# Altium schematic sheet 07.SchDoc
size 386 x 246 mm
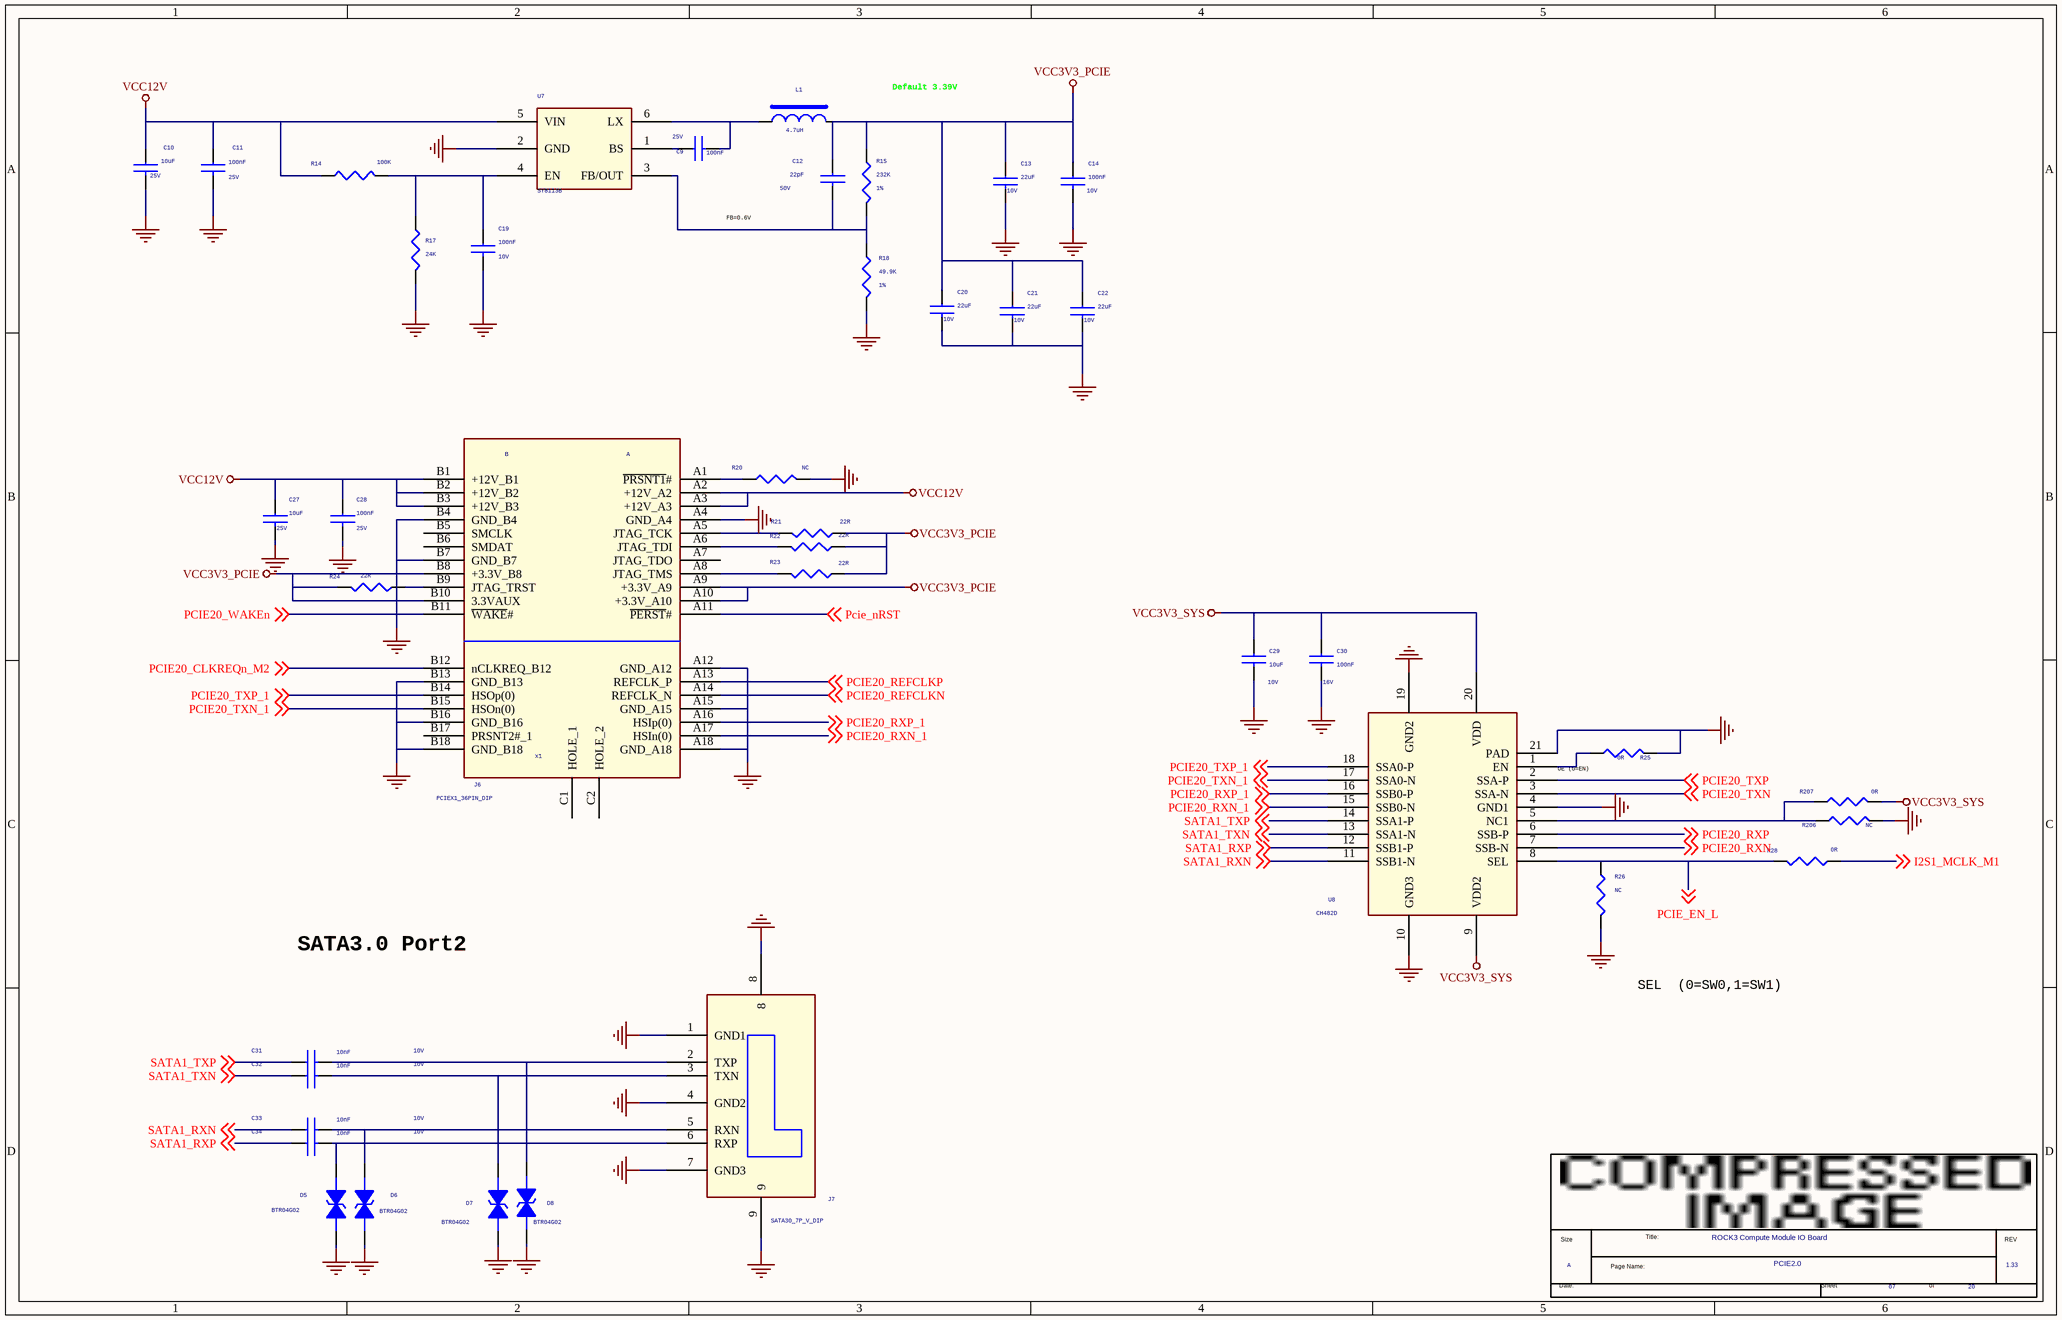
[diagram p0: 07.SchDoc]

## Parts
*  Page Count: 20  Page Number: 07  Page Size: A  Title: ROCK3 Compute Module IO Board  RevCode: 1.33  Doc: PCIE2.0  (hidden comment: radxa_1010)  (graphical)
C9  100nF  Voltage: 25V  [C0402]
C10  10uF  Voltage: 25V  [C1206]
C11  100nF  Voltage: 25V  [C0402]
C12  22pF  Voltage: 50V  [C0402]
C13  22uF  Voltage: 10V  [C0805]
C14  100nF  Voltage: 10V  [C0402]
C19  100nF  Voltage: 10V  [C0402]
C20  22uF  Voltage: 10V  [C0805]
C21  22uF  Voltage: 10V  [C0805]
C22  22uF  Voltage: 10V  [C0805]
C27  10uF  Voltage: 25V  [C1206]
C28  100nF  Voltage: 25V  [C0402]
C29  10uF  Voltage: 10V  [C0603]
C30  100nF  Voltage: 16V  [C0402]
C31  10nF  Voltage: 10V  [C0402]
C32  10nF  Voltage: 10V  [C0402]
C33  10nF  Voltage: 10V  [C0402]
C34  10nF  Voltage: 10V  [C0402]
D5  BTR04G02  [ESD0402_1xD5]
D6  BTR04G02  [ESD0402_1xD5]
D7  BTR04G02  [ESD0402_1xD5]
D8  BTR04G02  [ESD0402_1xD5]
J6  PCIEX1_36PIN_DIP  [PCIEX1_36PIN_DIP]
J7  SATA30_7P_V_DIP  [SMD_SATA_7P_50_180]
L1  4.7uH  [IND-5020]
R14  100K  [R0402]
R15  232K  Tolerance: 1%  [R0402]
R17  24K  [R0402]
R18  49.9K  Tolerance: 1%  [R0402]
R20  NC  [R0402]
R21  22R  [R0402]
R22  22R  [R0402]
R23  22R  [R0402]
R24  22R  [R0402]
R25  0R  [R0402]
R26  NC  [R0402]
R28  0R  [R0402]
R206  NC  [R0402]
R207  0R  [R0402]
U7  SY8113B  [SOT_23_6]
U8  CH482D  [CH482X]

## Nets
GND: C10.2 C11.2 C13.2 C14.2 C19.2 C20.2 C21.2 C22.2 C27.2 C28.2 C29.2 C30.2 D5.1 D6.1 D7.1 D8.1 J6.A4(GND_A4) J6.A12(GND_A12) J6.A15(GND_A15) J6.A18(GND_A18) J6.B4(GND_B4) J6.B7(GND_B7) J6.B13(GND_B13) J6.B16(GND_B16) J6.B18(GND_B18) J7.1(GND1) J7.4(GND2) J7.7(GND3) J7.8 J7.9 R17.2 R18.2 R20.2 R25.1 R26.2 R206.1 U7.2(GND) U8.4(GND1) U8.10(GND3) U8.19(GND2) U8.21(PAD)
VCC3V3_PCIE: C12.1 C13.1 C14.1 C20.1 C21.1 C22.1 J6.A9(+3.3V_A9) J6.A10(+3.3V_A10) J6.B8(+3.3V_B8) J6.B10(3.3VAUX) L1.2 R15.1 R21.2 R22.2 R23.2 R24.1
VCC3V3_SYS: C29.1 C30.1 R207.1 U8.9(VDD2) U8.20(VDD)
VCC12V: C10.1 C11.1 C27.1 C28.1 J6.A2(+12V_A2) J6.A3(+12V_A3) J6.B1(+12V_B1) J6.B2(+12V_B2) J6.B3(+12V_B3) R14.1 U7.5(VIN)
I2S1_MCLK_M1: R28.2 ; off-sheet I2S1_MCLK_M1
PCIE20_CLKREQn_M2: J6.B12(nCLKREQ_B12) ; off-sheet PCIE20_CLKREQn_M2
PCIE20_REFCLKN: J6.A14(REFCLK_N) ; off-sheet PCIE20_REFCLKN
PCIE20_REFCLKP: J6.A13(REFCLK_P) ; off-sheet PCIE20_REFCLKP
PCIE20_RXN: U8.7(SSB-N) ; off-sheet PCIE20_RXN
PCIE20_RXN_1: J6.A17(HSIn(0)) U8.15(SSB0-N) ; off-sheet PCIE20_RXN_1
PCIE20_RXP: U8.6(SSB-P) ; off-sheet PCIE20_RXP
PCIE20_RXP_1: J6.A16(HSIp(0)) U8.16(SSB0-P) ; off-sheet PCIE20_RXP_1
PCIE20_TXN: U8.3(SSA-N) ; off-sheet PCIE20_TXN
PCIE20_TXN_1: J6.B15(HSOn(0)) U8.17(SSA0-N) ; off-sheet PCIE20_TXN_1
PCIE20_TXP: U8.2(SSA-P) ; off-sheet PCIE20_TXP
PCIE20_TXP_1: J6.B14(HSOp(0)) U8.18(SSA0-P) ; off-sheet PCIE20_TXP_1
PCIE20_WAKEn: J6.B11(~{WAKE}#) ; off-sheet PCIE20_WAKEn
PCIE_EN_L: R26.1 R28.1 U8.8(SEL) ; off-sheet PCIE_EN_L
Pcie_nRST: J6.A11(~{PERST}#) ; off-sheet Pcie_nRST
SATA1_RXN: C33.1 U8.11(SSB1-N) ; off-sheet SATA1_RXN
SATA1_RXP: C34.1 U8.12(SSB1-P) ; off-sheet SATA1_RXP
SATA1_TXN: C32.1 U8.13(SSA1-N) ; off-sheet SATA1_TXN
SATA1_TXP: C31.1 U8.14(SSA1-P) ; off-sheet SATA1_TXP
NetC9_1: C9.1 U7.1(BS)
NetC9_2: C9.2 L1.1 U7.6(LX)
NetC12_2: C12.2 R15.2 R18.1 U7.3(FB/OUT)
NetC19_1: C19.1 R14.2 R17.1 U7.4(EN)
NetC31_2: C31.2 D8.2 J7.2(TXP)
NetC32_2: C32.2 D7.2 J7.3(TXN)
NetC33_2: C33.2 D6.2 J7.5(RXN)
NetC34_2: C34.2 D5.2 J7.6(RXP)
NetJ6_A1: J6.A1(~{PRSNT1}#) R20.1
NetJ6_A5: J6.A5(JTAG_TCK) R21.1
NetJ6_A6: J6.A6(JTAG_TDI) R22.1
NetJ6_A8: J6.A8(JTAG_TMS) R23.1
NetJ6_B9: J6.B9(JTAG_TRST) R24.2
NetR25_2: R25.2 U8.1(EN)
NetR206_2: R206.2 R207.2 U8.5(NC1)

Not connected (* = marked no-connect by the designer): J6 A7(JTAG_TDO) B5(SMCLK) B6(SMDAT) B17(PRSNT2#_1) C1(HOLE_1) C2(HOLE_2)

## Notes on the sheet
- Default 3.39V
- FB=0.6V
- (near R25) OE (0=EN)
- SATA3.0 Port2
- SEL  (0=SW0,1=SW1)
- (in symbol PCIE_4X_CON_1) B; x1
- (in symbol radxa_1010) Title:; Size; REV; Page Name:; Date:; Sheet; of

## Library data of the parts
C9 = CAP NP_0: cap,100.00nF,+/-10%,25V,X5R,C0402; Manufacturer: TDK; Number: 37; RK PN: C1005X5R1E104K050BC; Priority: A; Tolerance: 10%; C_Voltage: 6.3V; Dielectric: X5R; Part Type: C0402; Manufacturer PN: C1005X5R1E104K050BC; Created by: JJJ
C10 = CAP NP_0: cap,10.00uF,+/-10%,25V,X5R,C1206; Manufacturer: TDK; RK PN: C3216X5R1E106K085AC; Priority: A; C_Voltage: 6.3V; Tolerance: 10%; Dielectric: X5R; Part Type: C1206; Manufacturer PN: C3216X5R1E106K085AC; Created by: JJJ
C11 = CAP NP_0: cap,100.00nF,+/-10%,25V,X5R,C0402; Manufacturer PN: C1005X5R1E104K050BC; Manufacturer: TDK; Tolerance: 10%; Priority: A; Dielectric: X5R; Created by: JJJ; Part Type: C0402; RK PN: C1005X5R1E104K050BC
C12 = CAP NP_0: cap,22.00pF,+/-5%,50V,C0G,C0402; Manufacturer: TDK; RK PN: C1005C0G1H220J050BA; Priority: A; Tolerance: 5%; Dielectric: C0G; Part Type: C0402; Manufacturer PN: C1005C0G1H220J050BA; Created by: JJJ
C13 C21 C22 = CAP NP_0: cap,22.00uF,+/-10%,10V,X5R,C0805; Manufacturer: TDK; RK PN: C2012X5R1A226K125AB; Priority: A; C_Voltage: 6.3V; Tolerance: 10%; Dielectric: X5R; Part Type: C0805; Manufacturer PN: C2012X5R1A226K125AB; Created by: JJJ
C14 = CAP NP_0: cap,100.00nF,+/-10%,10V,X5R,C0402; Manufacturer: TDK; Number: 37; RK PN: C1005X5R1A104K050BA; Priority: A; Tolerance: 10%; C_Voltage: 6.3V; Dielectric: X5R; Part Type: C0402; Manufacturer PN: C1005X5R1A104K050BA; Created by: JJJ
C19 = CAP NP_0: cap,100.00nF,+/-10%,10V,X5R,C0402; Manufacturer PN: C1005X5R1A104K050BA; Manufacturer: TDK; C_Voltage: 6.3V; Tolerance: 10%; Priority: A; Number: 37; Dielectric: X5R; Created by: JJJ; Part Type: C0402; RK PN: C1005X5R1A104K050BA
C20 = CAP NP_0: cap,22.00uF,+/-10%,10V,X5R,C0805; Manufacturer PN: C2012X5R1A226K125AB; Manufacturer: TDK; Tolerance: 10%; C_Voltage: 6.3V; Priority: A; Dielectric: X5R; Created by: JJJ; Part Type: C0805; RK PN: C2012X5R1A226K125AB
C27 = CAP NP_0: cap,10.00uF,+/-10%,25V,X5R,C1206; Manufacturer PN: C3216X5R1E106K085AC; Manufacturer: TDK; Tolerance: 10%; C_Voltage: 6.3V; Priority: A; Dielectric: X5R; Created by: JJJ; Part Type: C1206; RK PN: C3216X5R1E106K085AC
C28 = CAP NP_0: cap,100.00nF,+/-10%,25V,X5R,C0402; Manufacturer: TDK; RK PN: C1005X5R1E104K050BC; Priority: A; Tolerance: 10%; Dielectric: X5R; Part Type: C0402; Manufacturer PN: C1005X5R1E104K050BC; Created by: JJJ
C29 = CAP NP_0: cap,22.00uF,+/-10%,10V,X5R,C0805; Manufacturer: TDK; RK PN: C2012X5R1A226K125AB; Priority: A; Tolerance: 10%; Dielectric: X5R; Part Type: C0805; Manufacturer PN: C2012X5R1A226K125AB; Created by: JJJ
C30 = CAP NP_0: cap,100.00nF,+/-10%,16V,X5R,C0402; Manufacturer: TDK; RK PN: C1005X5R1C104K050BA; Priority: A; Tolerance: 10%; Dielectric: X5R; Part Type: C0402; Manufacturer PN: C1005X5R1C104K050BA; Created by: JJJ
C31-C34 = CAP NP_0: cap,10.00nF,+/-10%,10V,X7R,C0201; Manufacturer PN: C0603X7R1A103K030BA; Manufacturer: TDK; Tolerance: 10%; Priority: A; Dielectric: X7R; Created by: JJJ; Part Type: C0201; RK PN: C0603X7R1A103K030BA
D5 D6 = DIODE BI_DIR TRIG_0: 1-Line, Bi-directional, Transient Voltage Suppressors.17.5pF.; Manufacturer: WillSemi(韦尔半导体); RK PN: ESD5451N; Priority: A; OPTION: DNP; Part Type: ESD_TVS; Manufacturer PN: ESD5451N; Created by: JJJ
D7 D8 = DIODE BI_DIR TRIG_0: 1-Line, Bi-directional, Transient Voltage Suppressors.17.5pF.; Manufacturer PN: ESD5451N; Manufacturer: WillSemi(韦尔半导体); OPTION: DNP; Priority: A; Created by: JJJ; Part Type: ESD_TVS; RK PN: ESD5451N
J6 = PCIE_4X_CON_1: PCIE 4X座子，立式，SMT；; Manufacturer Part Number: PCIE64_SMT; Priority: A; Part Type: PCIE; RK PN: PCIE64_SMT
J7 = SATA_DIP_1
L1 = INDUCTORS OF FERRITE_Dup1: Power Inductor,4.7uH,0.2,IND_606045; Manufacturer PN: SWPA6045S4R7MT; Manufacturer: sunlord; Isat: 4.97A; DC Resistor: 0.02ohm; Resonace frequency: 24M; Irms: 3.3A; Tolerance: 20%; Priority: A; Created by: YWQ; Part Type: POWER_IND; RK PN: SWPA6045S4R7MT
R14 = RESISTOR_0: 通用厚膜电阻,100K,+/-5%,R0402,1/16W.; Manufacturer PN: RC0402JR-07100KL; Manufacturer: YAGEO; Tolerance: 5%; Wattage: 1/16W; Priority: A; Created by: YTL; Part Type: 通用厚膜电阻; RK PN: RC0402JR-07100KL
R15 = RESISTOR_0: 通用厚膜电阻,232K,+/-1%,R0402,1/16W.; Manufacturer: YAGEO; RK PN: RC0402FR-07232KL; Priority: A; Wattage: 1/16W; Part Type: 通用厚膜电阻; Manufacturer PN: RC0402FR-07232KL; Created by: YTL
R17 = RESISTOR_0: 通用厚膜电阻,24K,+/-5%,R0402,1/16W.; Manufacturer: YAGEO; Tolerance: 5%; RK PN: RC0402JR-0724KL; Priority: A; Wattage: 1/16W; Part Type: 通用厚膜电阻; Manufacturer PN: RC0402JR-0724KL; Created by: YTL
R18 = RESISTOR_0: 通用厚膜电阻,49K9,+/-1%,R0402,1/16W.; Manufacturer PN: RC0402FR-0749K9L; Manufacturer: YAGEO; Wattage: 1/16W; Priority: A; Created by: YTL; Part Type: 通用厚膜电阻; RK PN: RC0402FR-0749K9L
R20 R206 = RESISTOR_0: 通用厚膜电阻,0R,+/-5%,R0402,1/16W.; Manufacturer: YAGEO; Tolerance: 5%; RK PN: RC0402JR-070RL; Priority: A; Wattage: 1/16W; Part Type: 通用厚膜电阻; Manufacturer PN: RC0402JR-070RL; Created by: YTL
R21 R22 R24 = RESISTOR_0: 通用厚膜电阻,10K,+/-5%,R0402,1/16W.; Manufacturer PN: RC0402JR-0710KL; Manufacturer: YAGEO; Tolerance: 5%; Wattage: 1/16W; Priority: A; Created by: YTL; Part Type: 通用厚膜电阻; RK PN: RC0402JR-0710KL
R23 = RESISTOR_0: 通用厚膜电阻,10K,+/-5%,R0402,1/16W.; Manufacturer: YAGEO; Tolerance: 5%; RK PN: RC0402JR-0710KL; Priority: A; Wattage: 1/16W; Part Type: 通用厚膜电阻; Manufacturer PN: RC0402JR-0710KL; Created by: YTL
R25 R207 = RESISTOR_0: 通用厚膜电阻,0R,+/-5%,R0402,1/16W.; Manufacturer PN: RC0402JR-070RL; Manufacturer: YAGEO; Tolerance: 5%; Wattage: 1/16W; Priority: A; Created by: YTL; Part Type: 通用厚膜电阻; RK PN: RC0402JR-070RL
R26 = RESISTOR_0: 通用厚膜电阻,4K7,+/-5%,R0402,1/16W.; Manufacturer: YAGEO; Tolerance: 5%; RK PN: RC0402JR-074K7L; Priority: A; Wattage: 1/16W; Part Type: 通用厚膜电阻; Manufacturer PN: RC0402JR-074K7L; Created by: YTL
R28 = RESISTOR_0: 通用厚膜电阻,100R,+/-5%,R0402,1/16W.; Manufacturer PN: RC0402JR-07100RL; Manufacturer: YAGEO; Tolerance: 5%; Wattage: 1/16W; Priority: A; Created by: YTL; Part Type: 通用厚膜电阻; RK PN: RC0402JR-07100RL
U7 = DCDC_SY8113: Manufacturer: Silergy（矽力杰）; Priority: A; Created by: JJJ; Manufacturer PN: SY8113B; Part Type: DCDC; RK PN: SY8113B
U8 = CH482X
* = radxa_1010: Page Create Date: March  8, 1995